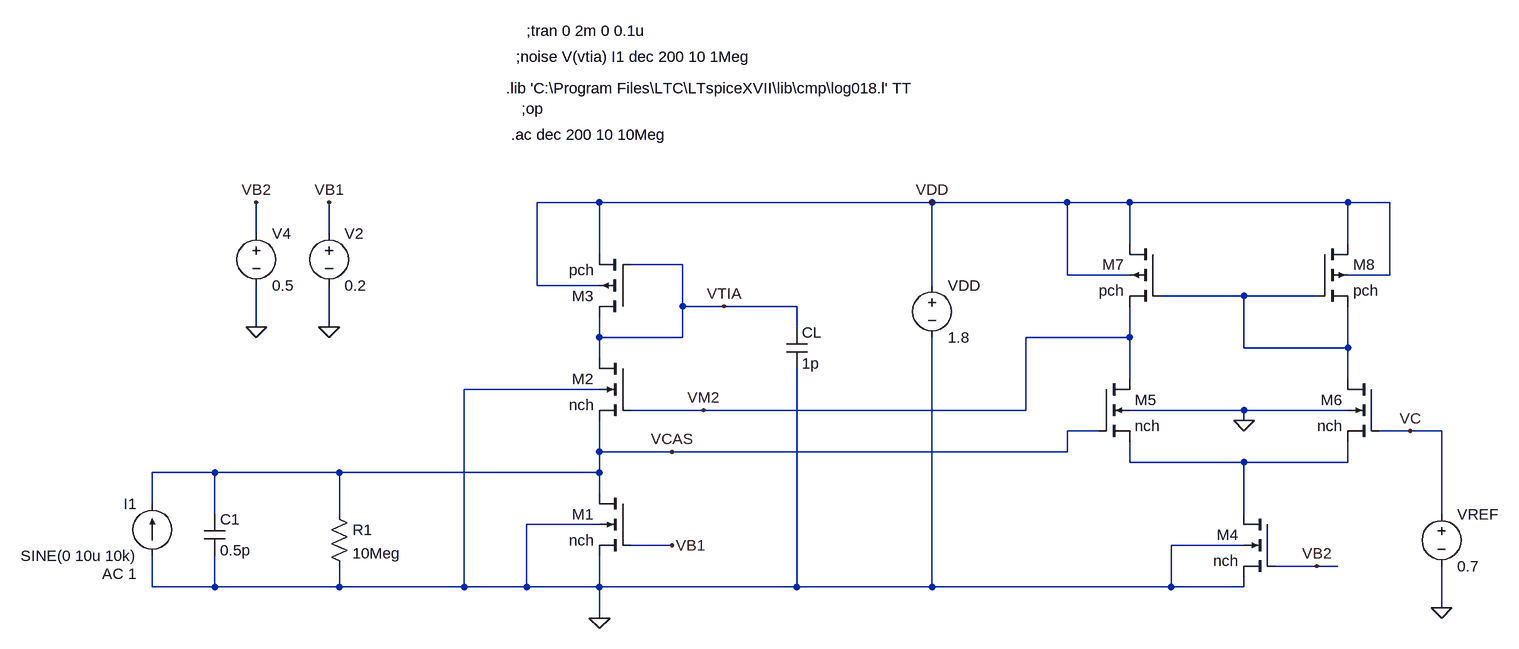
[diagram p0: schematic current_conveyor_tia.asc]
current_conveyor_tia.asc, the LTspice schematic file:
Version 4
SHEET 1 1192 1412
WIRE -192 -64 -288 -64
WIRE 320 -64 -192 -64
WIRE 528 -64 320 -64
WIRE 624 -64 528 -64
WIRE 960 -64 624 -64
WIRE 1024 -64 960 -64
WIRE -720 -16 -720 -64
WIRE -608 -16 -608 -64
WIRE 624 0 624 -64
WIRE 960 0 960 -64
WIRE -192 16 -192 -64
WIRE -64 32 -144 32
WIRE 528 48 528 -64
WIRE 624 48 528 48
WIRE 1024 48 1024 -64
WIRE 1024 48 960 48
WIRE -288 64 -288 -64
WIRE -192 64 -288 64
WIRE 320 64 320 -64
WIRE 800 80 672 80
WIRE 912 80 800 80
WIRE -64 96 -64 32
WIRE 0 96 -64 96
WIRE 112 96 0 96
WIRE -720 128 -720 64
WIRE -608 128 -608 64
WIRE 112 128 112 96
WIRE -192 144 -192 112
WIRE -64 144 -64 96
WIRE -64 144 -192 144
WIRE 624 144 624 96
WIRE 624 144 464 144
WIRE 800 160 800 80
WIRE 960 160 960 96
WIRE 960 160 800 160
WIRE -192 176 -192 144
WIRE 624 208 624 144
WIRE 960 208 960 160
WIRE -192 224 -400 224
WIRE -32 256 -144 256
WIRE 464 256 464 144
WIRE 464 256 -32 256
WIRE 800 256 624 256
WIRE 960 256 800 256
WIRE 800 272 800 256
WIRE 576 288 528 288
WIRE 1056 288 1008 288
WIRE 1104 288 1056 288
WIRE -192 320 -192 272
WIRE -80 320 -192 320
WIRE 528 320 528 288
WIRE 528 320 -80 320
WIRE 624 336 624 304
WIRE 800 336 624 336
WIRE 960 336 960 304
WIRE 960 336 800 336
WIRE -784 352 -880 352
WIRE -592 352 -784 352
WIRE -192 352 -192 320
WIRE -192 352 -592 352
WIRE -192 384 -192 352
WIRE -880 400 -880 352
WIRE -784 416 -784 352
WIRE -592 416 -592 352
WIRE 800 416 800 336
WIRE 1104 416 1104 288
WIRE -192 432 -304 432
WIRE -80 464 -144 464
WIRE 800 464 688 464
WIRE 912 496 848 496
WIRE 944 496 912 496
WIRE -880 528 -880 480
WIRE -784 528 -784 480
WIRE -784 528 -880 528
WIRE -592 528 -592 496
WIRE -592 528 -784 528
WIRE -400 528 -400 224
WIRE -400 528 -592 528
WIRE -304 528 -304 432
WIRE -304 528 -400 528
WIRE -192 528 -192 480
WIRE -192 528 -304 528
WIRE 112 528 112 192
WIRE 112 528 -192 528
WIRE 320 528 320 144
WIRE 320 528 112 528
WIRE 688 528 688 464
WIRE 688 528 320 528
WIRE 800 528 800 512
WIRE 800 528 688 528
WIRE 1104 560 1104 496
WIRE -192 576 -192 528
FLAG -192 576 0
FLAG 0 96 VTIA
FLAG -32 256 VM2
FLAG -80 464 VB1
FLAG -608 128 0
FLAG -608 -64 VB1
FLAG 320 -64 VDD
FLAG 800 272 0
FLAG 1056 288 VC
FLAG 912 496 VB2
FLAG -80 320 VCAS
FLAG 1104 560 0
FLAG -720 128 0
FLAG -720 -64 VB2
SYMBOL voltage 320 48 R0
WINDOW 123 0 0 Left 0
WINDOW 39 0 0 Left 0
SYMATTR InstName VDD
SYMATTR Value 1.8
SYMBOL pmos4 -144 112 R180
SYMATTR InstName M3
SYMATTR Value pch
SYMATTR Value2 l=2u w=1u
SYMBOL nmos4 -144 176 M0
SYMATTR InstName M2
SYMATTR Value nch
SYMATTR Value2 l=0.5u w=10u
SYMBOL nmos4 -144 384 M0
SYMATTR InstName M1
SYMATTR Value nch
SYMATTR Value2 l=0.5u w=20u
SYMBOL cap 96 128 R0
SYMATTR InstName CL
SYMATTR Value 1p
SYMBOL current -880 480 R180
WINDOW 0 24 80 Left 2
WINDOW 3 24 0 Left 2
WINDOW 123 24 -28 Left 2
WINDOW 39 0 0 Left 0
SYMATTR InstName I1
SYMATTR Value SINE(0 10u 10k)
SYMATTR Value2 AC 1
SYMBOL res -608 400 R0
SYMATTR InstName R1
SYMATTR Value 10Meg
SYMBOL cap -800 416 R0
SYMATTR InstName C1
SYMATTR Value 0.5p
SYMBOL voltage -608 -32 R0
WINDOW 123 0 0 Left 0
WINDOW 39 0 0 Left 0
SYMATTR InstName V2
SYMATTR Value 0.2
SYMBOL pmos4 672 0 M0
SYMATTR InstName M7
SYMATTR Value pch
SYMATTR Value2 l=0.5u w=2u
SYMBOL pmos4 912 0 R0
SYMATTR InstName M8
SYMATTR Value pch
SYMATTR Value2 l=0.5u w=2u
SYMBOL nmos4 576 208 R0
SYMATTR InstName M5
SYMATTR Value nch
SYMATTR Value2 l=0.5u w=2u
SYMBOL nmos4 1008 208 M0
SYMATTR InstName M6
SYMATTR Value nch
SYMATTR Value2 l=0.5u w=2u
SYMBOL nmos4 848 416 M0
SYMATTR InstName M4
SYMATTR Value nch
SYMATTR Value2 l=0.5u w=1u
SYMBOL voltage 1104 400 R0
WINDOW 123 0 0 Left 0
WINDOW 39 0 0 Left 0
SYMATTR InstName VREF
SYMATTR Value 0.7
SYMBOL voltage -720 -32 R0
WINDOW 123 0 0 Left 0
WINDOW 39 0 0 Left 0
SYMATTR InstName V4
SYMATTR Value 0.5
TEXT -336 -240 Left 2 !.lib 'C:\\Program Files\\LTC\\LTspiceXVII\\lib\\cmp\\log018.l' TT
TEXT -312 -208 Left 2 !;op
TEXT -328 -168 Left 2 !.ac dec 200 10 10Meg
TEXT -320 -288 Left 2 !;noise V(vtia) I1 dec 200 10 1Meg
TEXT -304 -328 Left 2 !;tran 0 2m 0 0.1u

The netlist it stands for:
* current_conveyor_tia.asc
VDD VDD 0 1.8
M3 VTIA VTIA VDD VDD pch l=2u w=1u
M2 VTIA VM2 VCAS 0 nch l=0.5u w=10u
M1 VCAS VB1 0 0 nch l=0.5u w=20u
CL VTIA 0 1p
I1 0 VCAS SINE(0 10u 10k) AC 1
R1 VCAS 0 10Meg
C1 VCAS 0 0.5p
V2 VB1 0 0.2
M7 VDD N001 VM2 VDD pch l=0.5u w=2u
M8 VDD N001 N001 VDD pch l=0.5u w=2u
M5 VM2 VCAS N002 0 nch l=0.5u w=2u
M6 N001 VC N002 0 nch l=0.5u w=2u
M4 N002 VB2 0 0 nch l=0.5u w=1u
VREF VC 0 0.7
V4 VB2 0 0.5
.model NMOS NMOS
.model PMOS PMOS
.lib standard.mos
.lib 'C:\Program Files\LTC\LTspiceXVII\lib\cmp\log018.l' TT
;op
.ac dec 200 10 10Meg
;noise V(vtia) I1 dec 200 10 1Meg
;tran 0 2m 0 0.1u
.backanno
.end